# Altium schematic sheet [10] - CPU - GPIO, PWM, LEDS, BUTTONS.SchDoc
size A2; DocumentNumber: 10; SheetNumber: 10; SheetTotal: 32
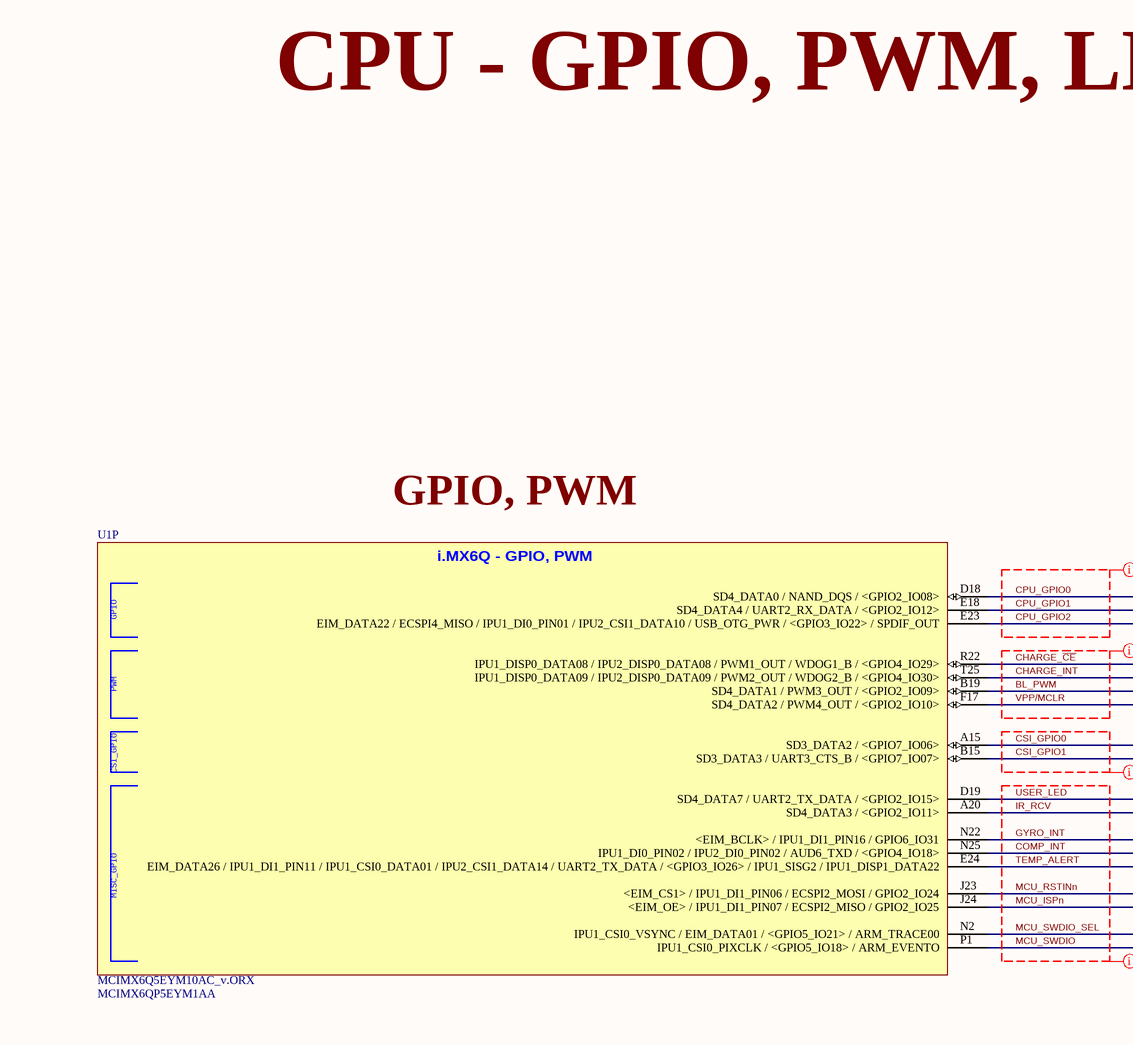
[diagram p0: [10] - CPU - GPIO, PWM, LEDS, BUTTONS.SchDoc, top left]
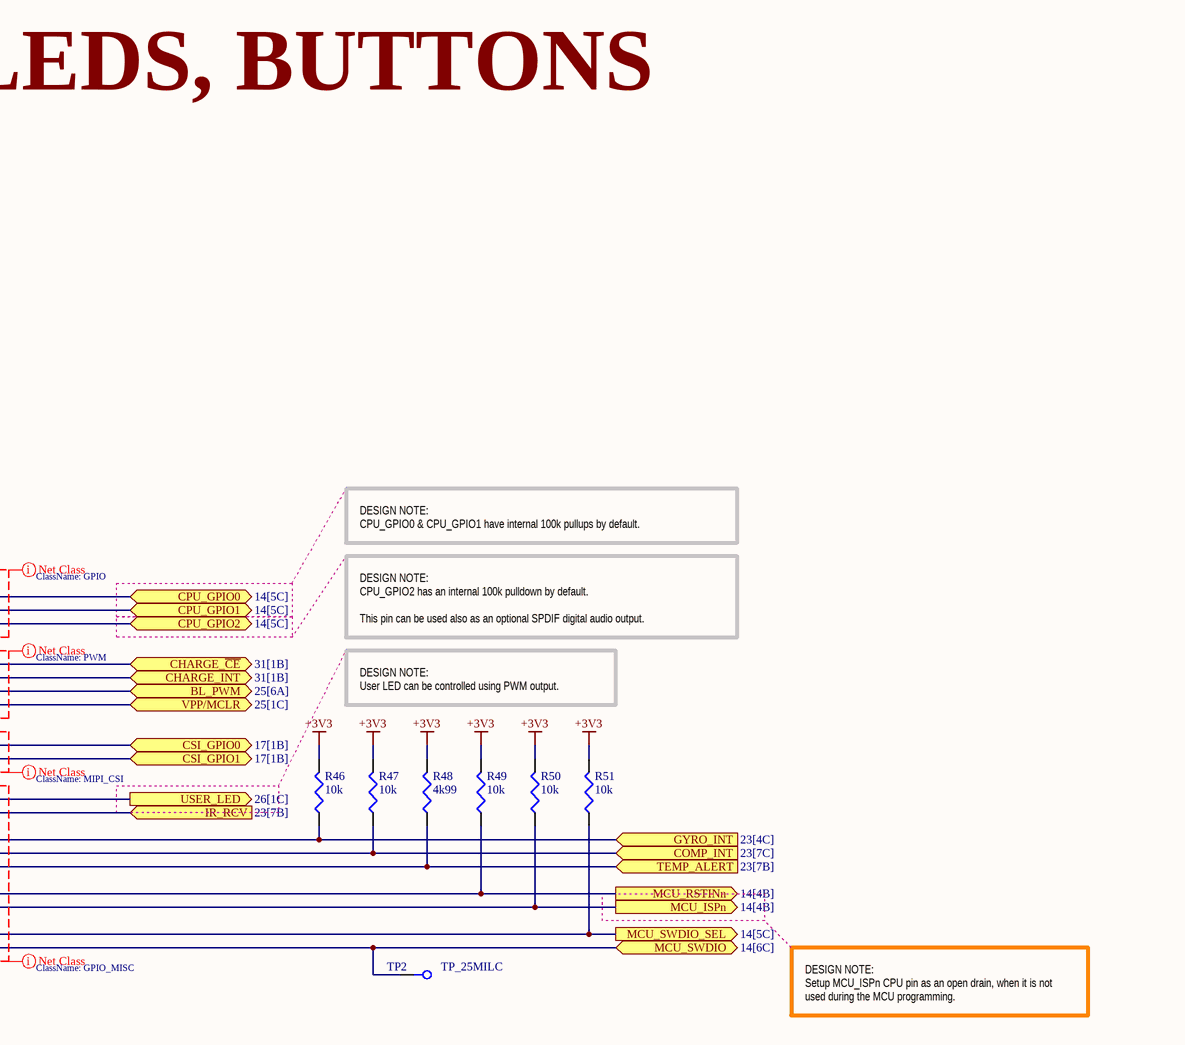
[diagram p1: [10] - CPU - GPIO, PWM, LEDS, BUTTONS.SchDoc, top right]
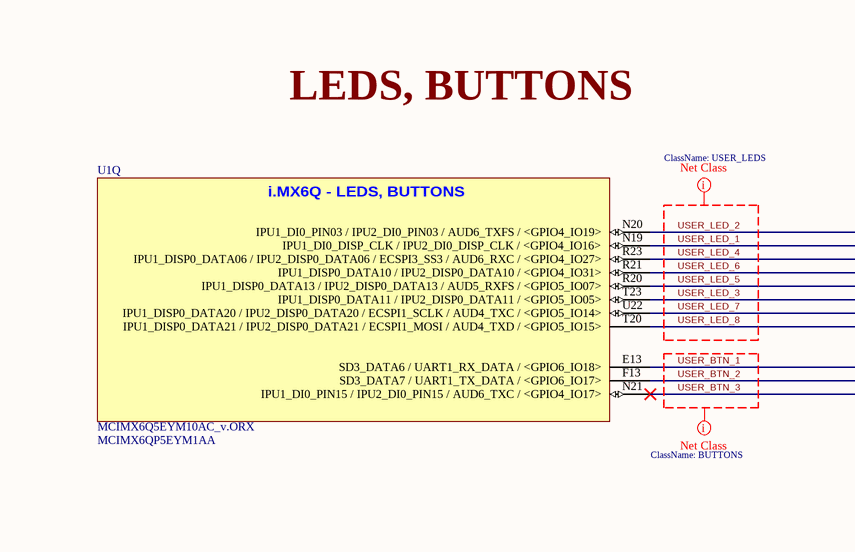
[diagram p2: [10] - CPU - GPIO, PWM, LEDS, BUTTONS.SchDoc, bottom left]
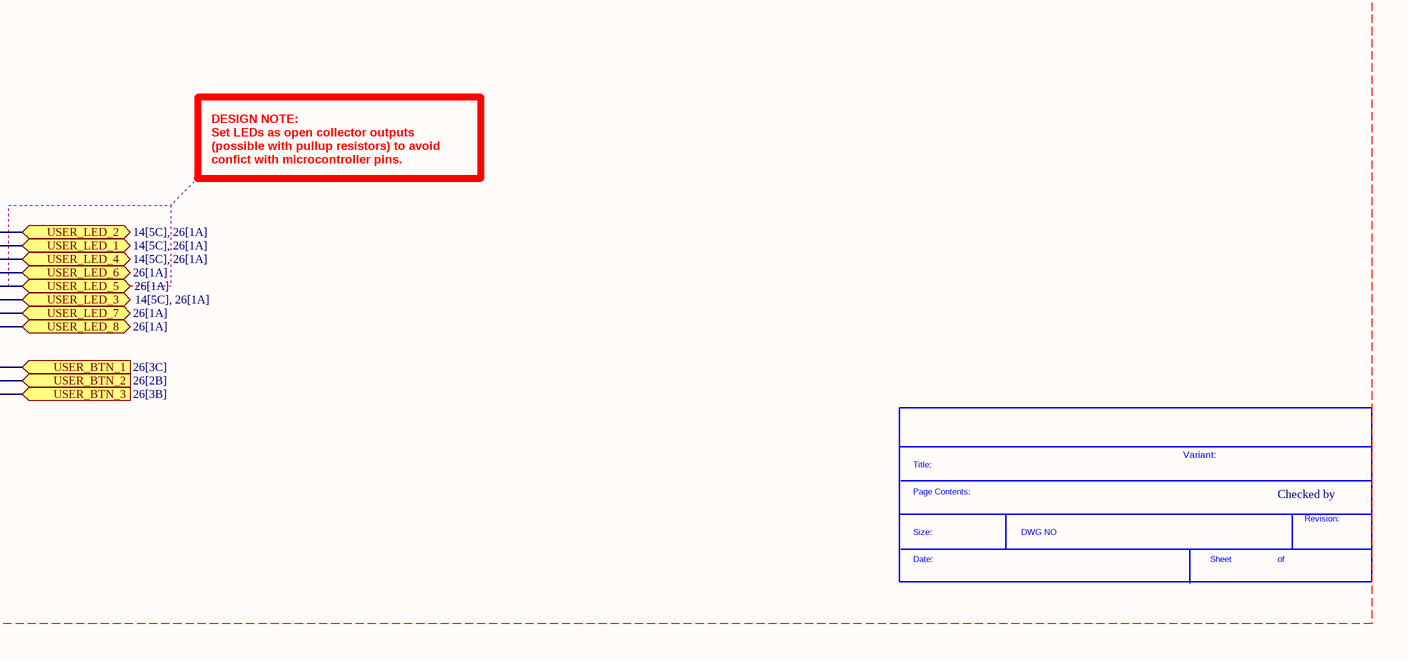
[diagram p3: [10] - CPU - GPIO, PWM, LEDS, BUTTONS.SchDoc, bottom right]

## Parts
*  SDTitleBlock  (value not drawn)  (graphical)
R46  10k  [R0402]
R47  10k  [R0402]
R48  4k99  [R0402]
R49  10k  [R0402]
R50  10k  [R0402]
R51  10k  [R0402]
TP2  TP_25MILC  [TP_25C]  (no BOM)
U1  MCIMX6Q5EYM10AC_v.ORX  Supplier Part Number 2: MCIMX6QP5EYM1AA  [PBGA624]  (parts P,Q of 23)

## Ports
BL_PWM (bidir, see 25[6A]), CHARGE_INT (bidir, see 31[1B]), CHARGE_~{CE} (bidir, see 31[1B]), COMP_INT (in, see 23[7C]), CPU_GPIO0 (bidir, see 14[5C]), CPU_GPIO1 (bidir, see 14[5C]), CPU_GPIO2 (bidir, see 14[5C]), CSI_GPIO0 (bidir, see 17[1B]), CSI_GPIO1 (bidir, see 17[1B]), GYRO_INT (in, see 23[4C]), IR_RCV (in, see 23[7B]), MCU_ISPn (out, see 14[4B]), MCU_RSTINn (out, see 14[4B]), MCU_SWDIO (bidir, see 14[6C]), MCU_SWDIO_SEL (out, see 14[5C]), TEMP_ALERT (in, see 23[7B]), USER_BTN_1 (in, see 26[3C]), USER_BTN_2 (in, see 26[2B]), USER_BTN_3 (in, see 26[3B]), USER_LED (out, see 26[1C]), USER_LED_1 (bidir, see 14[5C], 26[1A]), USER_LED_2 (bidir, see 14[5C], 26[1A]), USER_LED_3 (bidir, see 14[5C], 26[1A]), USER_LED_4 (bidir, see 14[5C], 26[1A]), USER_LED_5 (bidir, see 26[1A]), USER_LED_6 (bidir, see 26[1A]), USER_LED_7 (bidir, see 26[1A]), USER_LED_8 (bidir, see 26[1A]), VPP/MCLR (bidir, see 25[1C])

## Nets
+3V3: R46.2 R47.2 R48.2 R49.2 R50.2 R51.2
BL_PWM: U1.B19(SD4_DATA1_/_PWM3_OUT_/_<GPIO2_IO09>) ; port BL_PWM
CHARGE_~{CE}: U1.R22(IPU1_DISP0_DATA08_/_IPU2_DISP0_DATA08_/_PWM1_OUT_/_WDOG1_B_/_<GPIO4_IO29>) ; port CHARGE_~{CE}
CHARGE_INT: U1.T25(IPU1_DISP0_DATA09_/_IPU2_DISP0_DATA09_/_PWM2_OUT_/_WDOG2_B_/_<GPIO4_IO30>) ; port CHARGE_INT
COMP_INT: R47.1 U1.N25(IPU1_DI0_PIN02_/_IPU2_DI0_PIN02_/_AUD6_TXD_/_<GPIO4_IO18>) ; port COMP_INT
CPU_GPIO0: U1.D18(SD4_DATA0_/_NAND_DQS_/_<GPIO2_IO08>) ; port CPU_GPIO0
CPU_GPIO1: U1.E18(SD4_DATA4_/_UART2_RX_DATA_/_<GPIO2_IO12>) ; port CPU_GPIO1
CPU_GPIO2: U1.E23(EIM_DATA22_/_ECSPI4_MISO_/_IPU1_DI0_PIN01_/_IPU2_CSI1_DATA10_/_USB_OTG_PWR_/_<GPIO3_IO22>_/_SPDIF_OUT) ; port CPU_GPIO2
CSI_GPIO0: U1.A15(SD3_DATA2_/_<GPIO7_IO06>) ; port CSI_GPIO0
CSI_GPIO1: U1.B15(SD3_DATA3_/_UART3_CTS_B_/_<GPIO7_IO07>) ; port CSI_GPIO1
GYRO_INT: R46.1 U1.N22(<EIM_BCLK>_/_IPU1_DI1_PIN16_/_GPIO6_IO31) ; port GYRO_INT
IR_RCV: U1.A20(SD4_DATA3_/_<GPIO2_IO11>) ; port IR_RCV
MCU_ISPn: R50.1 U1.J24(<EIM_OE>_/_IPU1_DI1_PIN07_/_ECSPI2_MISO_/_GPIO2_IO25) ; port MCU_ISPn
MCU_RSTINn: R49.1 U1.J23(<EIM_CS1>_/_IPU1_DI1_PIN06_/_ECSPI2_MOSI_/_GPIO2_IO24) ; port MCU_RSTINn
MCU_SWDIO: TP2.1 U1.P1(IPU1_CSI0_PIXCLK_/_<GPIO5_IO18>_/_ARM_EVENTO) ; port MCU_SWDIO
MCU_SWDIO_SEL: R51.1 U1.N2(IPU1_CSI0_VSYNC_/_EIM_DATA01_/_<GPIO5_IO21>_/_ARM_TRACE00) ; port MCU_SWDIO_SEL
TEMP_ALERT: R48.1 U1.E24(EIM_DATA26_/_IPU1_DI1_PIN11_/_IPU1_CSI0_DATA01_/_IPU2_CSI1_DATA14_/_UART2_TX_DATA_/_<GPIO3_IO26>_/_IPU1_SISG2_/_IPU1_DISP1_DATA22) ; port TEMP_ALERT
USER_BTN_1: U1.E13(SD3_DATA6_/_UART1_RX_DATA_/_<GPIO6_IO18>) ; port USER_BTN_1
USER_BTN_2: U1.F13(SD3_DATA7_/_UART1_TX_DATA_/_<GPIO6_IO17>) ; port USER_BTN_2
USER_BTN_3: U1.N21(IPU1_DI0_PIN15_/_IPU2_DI0_PIN15_/_AUD6_TXC_/_<GPIO4_IO17>) ; port USER_BTN_3
USER_LED: U1.D19(SD4_DATA7_/_UART2_TX_DATA_/_<GPIO2_IO15>) ; port USER_LED
USER_LED_1: U1.N19(IPU1_DI0_DISP_CLK_/_IPU2_DI0_DISP_CLK_/_<GPIO4_IO16>) ; port USER_LED_1
USER_LED_2: U1.N20(IPU1_DI0_PIN03_/_IPU2_DI0_PIN03_/_AUD6_TXFS_/_<GPIO4_IO19>) ; port USER_LED_2
USER_LED_3: U1.T23(IPU1_DISP0_DATA11_/_IPU2_DISP0_DATA11_/_<GPIO5_IO05>) ; port USER_LED_3
USER_LED_4: U1.R23(IPU1_DISP0_DATA06_/_IPU2_DISP0_DATA06_/_ECSPI3_SS3_/_AUD6_RXC_/_<GPIO4_IO27>) ; port USER_LED_4
USER_LED_5: U1.R20(IPU1_DISP0_DATA13_/_IPU2_DISP0_DATA13_/_AUD5_RXFS_/_<GPIO5_IO07>) ; port USER_LED_5
USER_LED_6: U1.R21(IPU1_DISP0_DATA10_/_IPU2_DISP0_DATA10_/_<GPIO4_IO31>) ; port USER_LED_6
USER_LED_7: U1.U22(IPU1_DISP0_DATA20_/_IPU2_DISP0_DATA20_/_ECSPI1_SCLK_/_AUD4_TXC_/_<GPIO5_IO14>) ; port USER_LED_7
USER_LED_8: U1.T20(IPU1_DISP0_DATA21_/_IPU2_DISP0_DATA21_/_ECSPI1_MOSI_/_AUD4_TXD_/_<GPIO5_IO15>) ; port USER_LED_8
VPP/MCLR: U1.F17(SD4_DATA2_/_PWM4_OUT_/_<GPIO2_IO10>) ; port VPP/MCLR

## Layout directives
net class PWM: BL_PWM, CHARGE_INT, CHARGE_~{CE}, VPP/MCLR
net class GPIO: CPU_GPIO0, CPU_GPIO1, CPU_GPIO2
net class GPIO_MISC: COMP_INT, GYRO_INT, IR_RCV, MCU_ISPn, MCU_RSTINn, MCU_SWDIO, MCU_SWDIO_SEL, TEMP_ALERT, USER_LED
net class USER_LEDS: USER_LED_1, USER_LED_2, USER_LED_3, USER_LED_4, USER_LED_5, USER_LED_6, USER_LED_7, USER_LED_8
net class BUTTONS: USER_BTN_1, USER_BTN_2, USER_BTN_3
net class MIPI_CSI: CSI_GPIO0, CSI_GPIO1
net class [10] - CPU - GPIO/PWM/LEDS/BUTTONS: +3V3, BL_PWM, CHARGE_INT, CHARGE_~{CE}, COMP_INT, CPU_GPIO0, CPU_GPIO1, CPU_GPIO2, CSI_GPIO0, CSI_GPIO1, GYRO_INT, IR_RCV, MCU_ISPn, MCU_RSTINn, MCU_SWDIO, MCU_SWDIO_SEL, TEMP_ALERT, USER_BTN_1, USER_BTN_2, USER_BTN_3, USER_LED, USER_LED_1, USER_LED_2, USER_LED_3, USER_LED_4, USER_LED_5, USER_LED_6, USER_LED_7, USER_LED_8, VPP/MCLR

## Notes on the sheet
- CPU - GPIO, PWM, LEDS, BUTTONS
- GPIO, PWM
- DESIGN NOTE:
  CPU_GPIO0 & CPU_GPIO1 have internal 100k pullups by default.
- DESIGN NOTE:
  CPU_GPIO2 has an internal 100k pulldown by default.
  This pin can be used also as an optional SPDIF digital audio output.
- DESIGN NOTE:
  User LED can be controlled using PWM output.
- DESIGN NOTE:
  Setup MCU_ISPn CPU pin as an open drain, when it is not used during the MCU programming.
- LEDS, BUTTONS
- DESIGN NOTE:
  Set LEDs as open collector outputs (possible with pullup resistors) to avoid confict with microcontroller pins.
- Variant:
- Checked by
- (in symbol MCIMX6Q5EYM10AC_v.ORX, part P) i.MX6Q - GPIO, PWM; GPIO; PWM; CSI_GPIO; MISC_GPIO
- (in symbol MCIMX6Q5EYM10AC_v.ORX, part Q) i.MX6Q - LEDS, BUTTONS
- (in symbol SDTitleBlock) Title:; Page Contents:; Revision:; Size:; DWG NO; Date:; Sheet; of

## Library data of the parts
R46 R47 R49-R51 = RC0402FR-0710KL: RES 10.0K OHM 1/16W 1% 0402 SMD; Manufacturer: Yageo; Power (Watts): 0.063W, 1/16W; .Checked PCB: used; Temperature Coefficient: ±100ppm/°C; Category: Resistors; Supplier Part Number: 311-10.0KLRCT-ND; Manufacturer Part Number: RC0402FR-0710KL; Package / Case: 0402 (1005 Metric); Price 1k [$]: 0.01421; Resistance (Ohms): 10K; Tolerance: ±1%; Value: 10k; .Checked SCH: used; Supplier: Digikey; Supplier 1: Digi-Key; Supplier Part Number 1: 311-10.0KLRCT-ND; RoHS: RoHS Compliant; Stock 1: 2916495; Pricing 1: 10=0.014, 50=0.0104, 100=0.0079, 250=0.00584, 500=0.00432, 1000=0.00288 (USD); Composition: Thick Film; Features: -; Size / Dimension: 0.039" L x 0.020" W (1.00mm x 0.50mm); Height: 0.016" (0.40mm); Number of Terminations: 2; Packaging: Cut Tape (CT); ComponentLink1URL: http://www.yageo.com/documents/recent/PYu-RC0402_51_RoHS_L_6.pdf; ComponentLink1Description: http://www.yageo.com/documents/recent/PYu-RC0402_51_RoHS_L_6.pdf
R48 = RMCF0402FT4K99: RES TF 4.99K OHM 1% 1/16W 0402; Manufacturer: Stackpole Electronics Inc; Power (Watts): 0.063W, 1/16W; .Checked PCB: used; Temperature Coefficient: ±100ppm/°C; Category: Resistors; Supplier Part Number: RMCF0402FT4K99CT-ND; Manufacturer Part Number: RMCF0402FT4K99; Package / Case: 0402 (1005 Metric); Price 1k [$]: 0.00384; Resistance (Ohms): 4.99K; Tolerance: ±1%; Value: 4k99; .Checked SCH: used; Supplier: Digikey; Supplier 1: Digi-Key; Supplier Part Number 1: RMCF0402FT4K99CT-ND; RoHS: RoHS Compliant; Stock 1: 48509; Pricing 1: 1=0.04, 10=0.025, 50=0.0138, 100=0.0105, 250=0.0078, 500=0.00576, 1000=0.00384 (USD); Composition: Thick Film; Features: -; Size / Dimension: 0.039" L x 0.020" W (1.00mm x 0.50mm); Height: 0.016" (0.40mm); Number of Terminations: 2; Packaging: Cut Tape (CT); ComponentLink1URL: http://www.seielect.com/Catalog/SEI-RMCF.pdf; ComponentLink1Description: http://www.seielect.com/Catalog/SEI-RMCF.pdf
TP2 = TP_25MILC: Test Point 25mil; .Checked PCB: used
U1 = MCIMX6Q5EYM10AC_v.ORX: IC MCU 32BIT ARM QUAD 624FCBGA; Manufacturer: Freescale Semiconductor; Core Processor: ARM® Cortex™-A9; Core Size: 32-Bit Quad-Core; Speed: 1.0GHz; Connectivity: CAN, EBI/EMI, ESAI, Ethernet, GPMI, I2C, MMC/SD, PCI, SATA, SPI, UART, USB, USB OTG; Peripherals: DMA, HDMI, I2S/SSI/AC97, MIPI CSI, MIMI DSI, MIPI HIS, PWM, WDT; Number of I /O: 224; Program Memory Type: External Program Memory; RAM Size: 256K x 8; Voltage - Supply (Vcc/Vdd): 0.925 V ~ 1.5 V; Oscillator Type: Internal; .Creator: MM; .Checked PCB: used; Supplier 1: Digi-Key; Manufacturer Part Number: MCIMX6Q5EYM10AC; RoHS: RoHS Compliant; Category: Integrated Circuits (ICs); Stock 1: 0; Pricing 1: 1=54.98, 10=51.922, 25=48.868, 100=30.5424 (USD); Program Memory Size: -; EEPROM Size: -; Data Converters: -; Operating Temperature: -20°C ~ 105°C; Package / Case: 624-FBGA, FCBGA; Packaging: Tray; ComponentLink1URL: http://cache.freescale.com/files/32bit/doc/data_sheet/IMX6DQCEC.pdf; ComponentLink1Description: Data Sheet; Supplier Part Number 1: MCIMX6Q5EYM10AC-ND; .Checked SCH: used; ComponentLink2Description: User Guide; ComponentLink2URL: file:///C:/Users/mbeach/Downloads/i.MX_Linux_User's_Guide.pdf; Supplier 2: Arrow